# Altium schematic sheet SMPS.SchDoc: LiOn Drill Charger (part 1 of 3)
size A2; CompanyName: RADWAG Wagi Elektroniczne; Organization: RADWAG Wagi Elektroniczne; Address1: ul. Bracka 28; Address2: 26-600 RADOM; Address3: POLAND; SheetNumber: 1; SheetTotal: 1
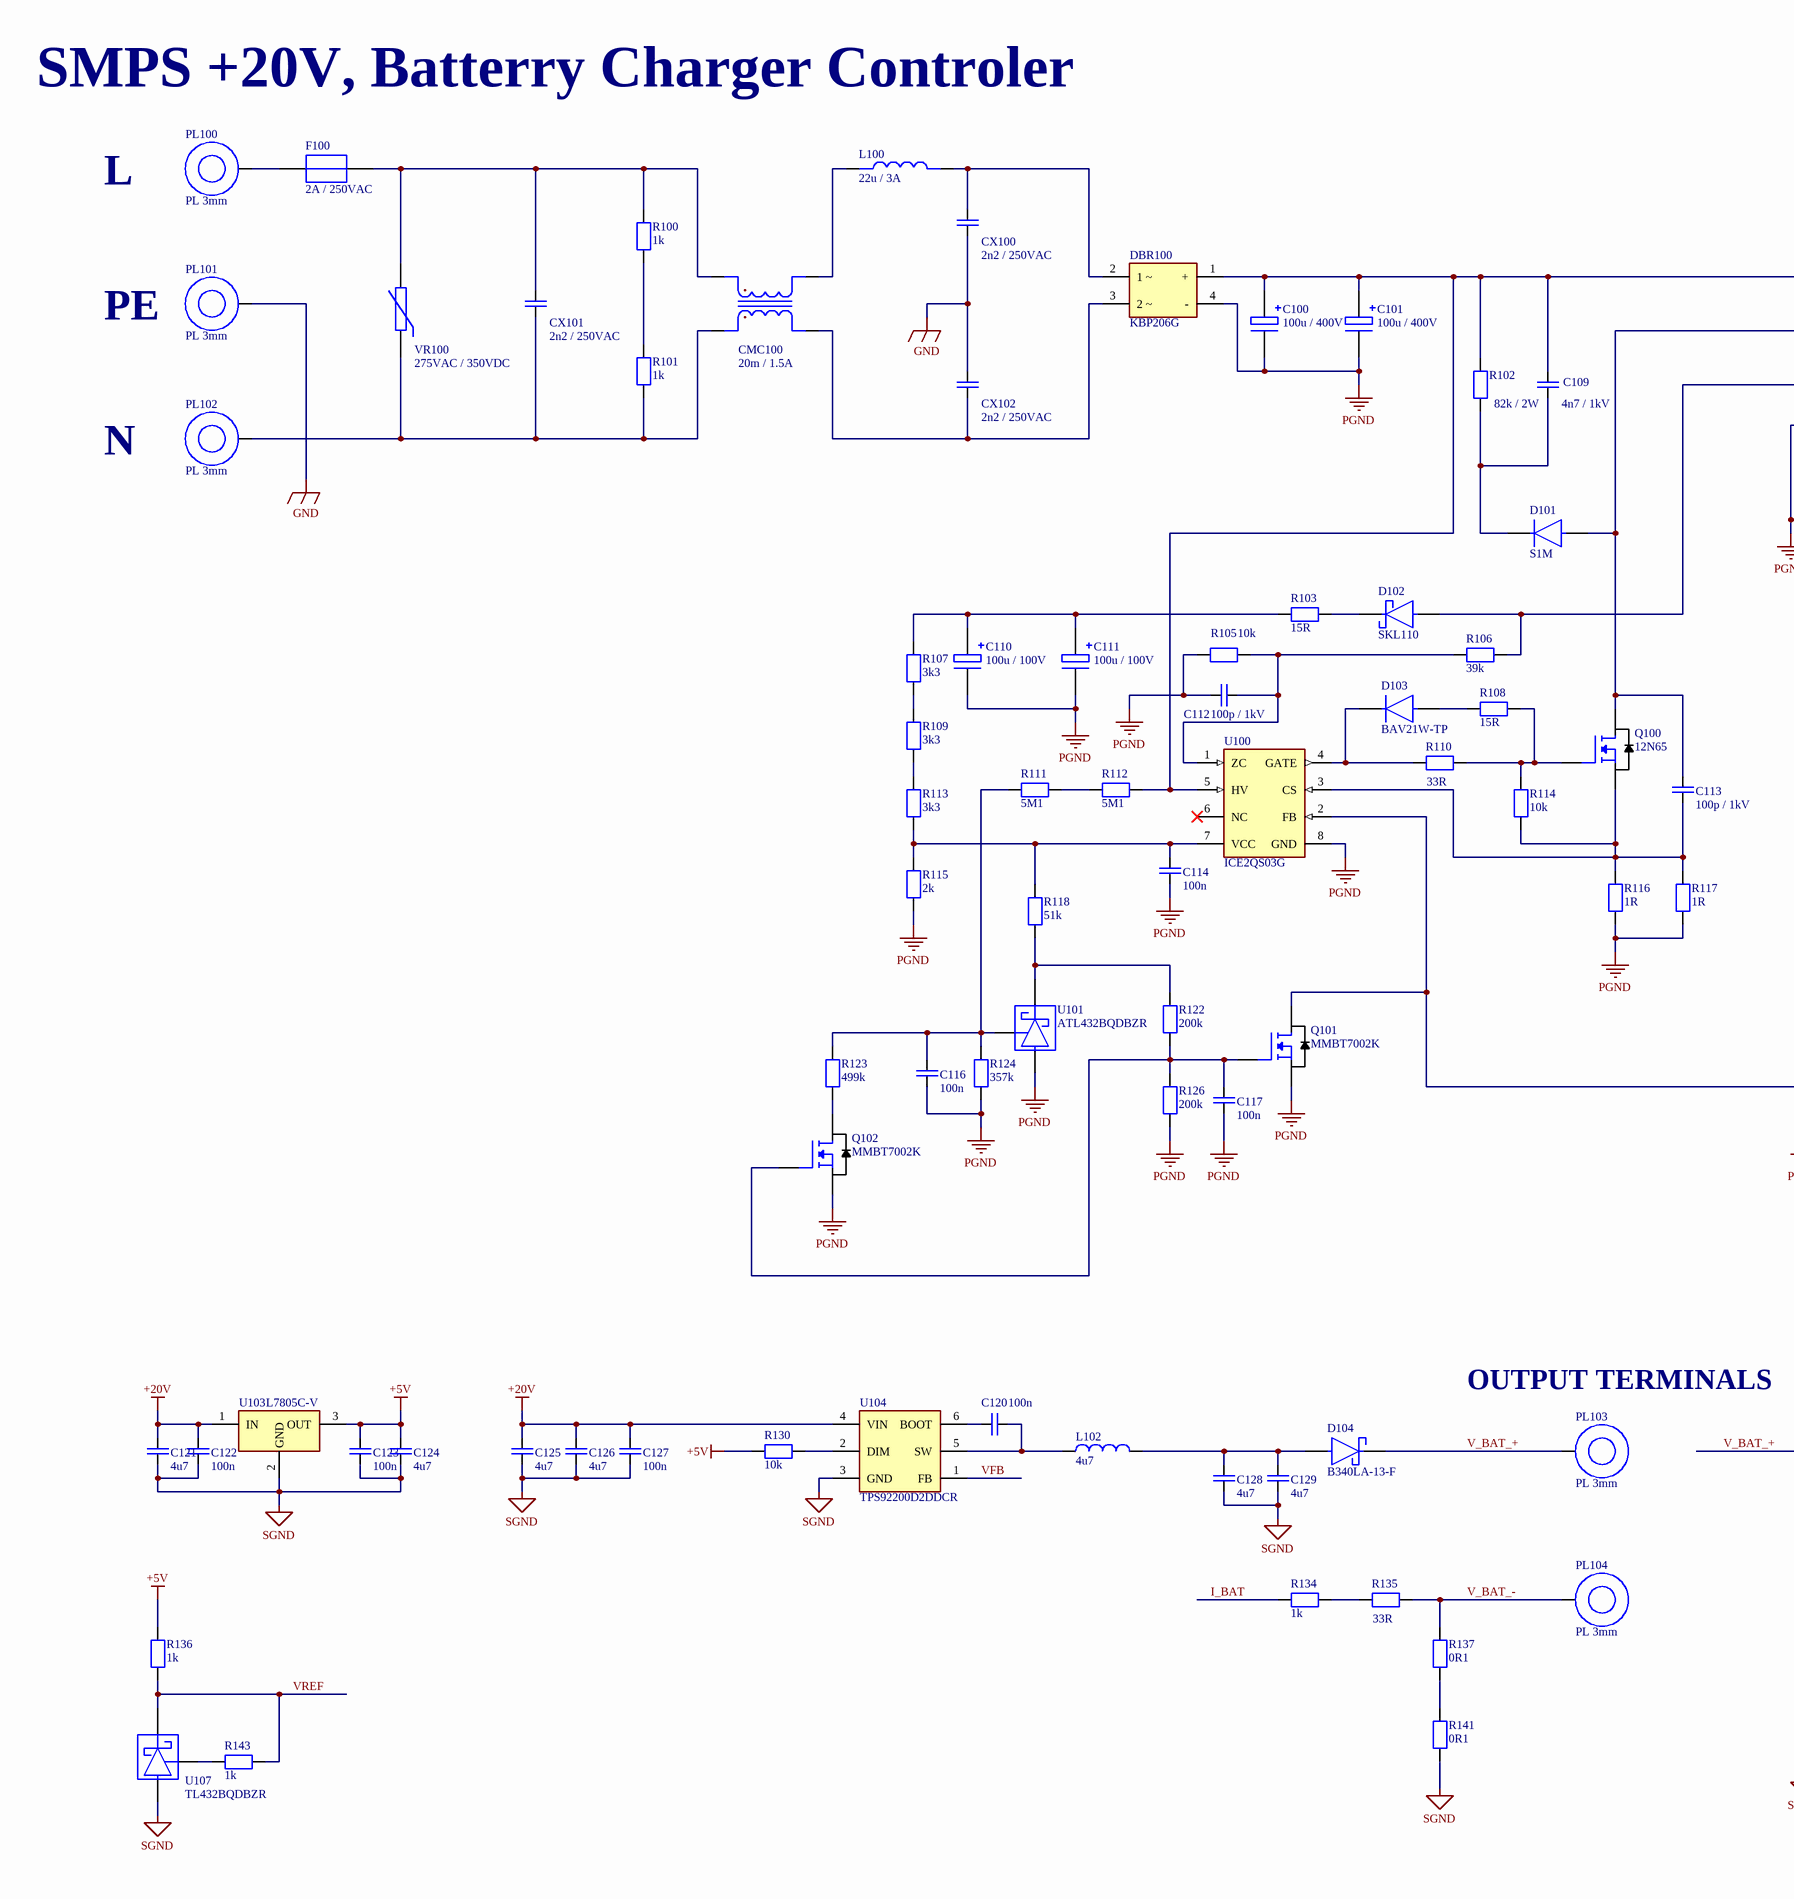
[diagram p0: SMPS.SchDoc, left]
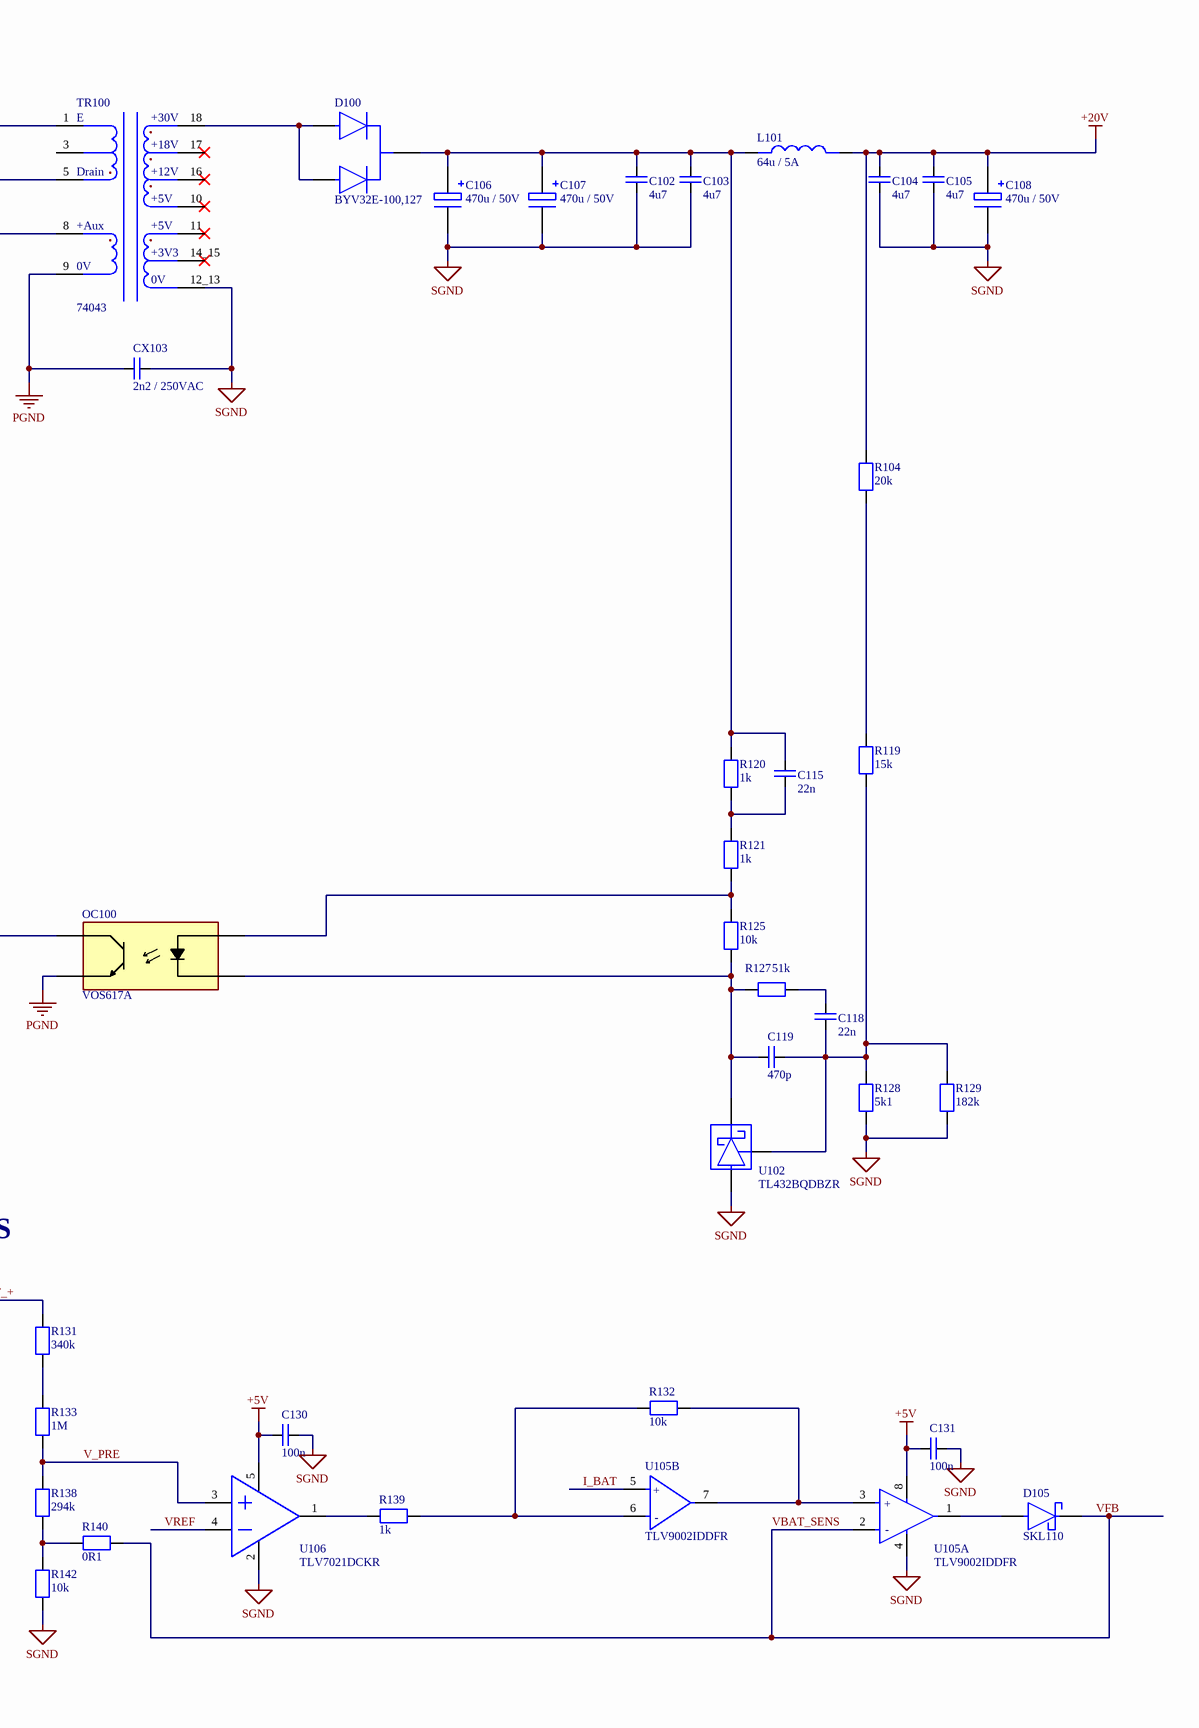
[diagram p1: SMPS.SchDoc, right]

## Parts
C100  100u / 400V  [EL_CAP_16X7_5]
C101  100u / 400V  [EL_CAP_16X7_5]
C102  4u7  [C0805]
C103  4u7  [C0805]
C104  4u7  [C0805]
C105  4u7  [C0805]
C106  470u / 50V  [EL_CAP_12_5X5]
C107  470u / 50V  [EL_CAP_12_5X5]
C108  470u / 50V  [EL_CAP_12_5X5]
C109  4n7 / 1kV  [C1206]
C110  100u / 100V  [EL_CAP_10X5]
C111  100u / 100V  [EL_CAP_10X5]
C112  100p / 1kV  [FILM_CAP_R5MM_4_5X6X7_2]
C113  100p / 1kV  [FILM_CAP_R5MM_4_5X6X7_2]
C114  100n  [C1206]
C115  22n  [C0603]
C116  100n  [C1206]
C117  100n  [C1206]
C118  22n  [C0603]
C119  470p  [C0603]
C120  100n  [C1206]
C121  4u7  [C0805]
C122  100n  [C1206]
C123  100n  [C1206]
C124  4u7  [C0805]
C125  4u7  [C0805]
C126  4u7  [C0805]
C127  100n  [C1206]
C128  4u7  [C0805]
C129  4u7  [C0805]
C130  100n  [C1206]
C131  100n  [C1206]
CMC100  20m / 1.5A  [EV28CMC]
CX100  2n2 / 250VAC  [CX_THT_CAP_R_7_5_FI8]
CX101  2n2 / 250VAC  [CX_THT_CAP_R_7_5_FI8]
CX102  2n2 / 250VAC  [CX_THT_CAP_R_7_5_FI8]
CX103  2n2 / 250VAC  [CX_THT_CAP_R_7_5_FI8]
D100  BYV32E-100,127  [TO220AB]
D101  S1M  [SMA]
D102  SKL110  [SOD123FL]
D103  BAV21W-TP  [SOD123FL]
D104  B340LA-13-F  [SMA]
D105  SKL110  [SOD123FL]
DBR100  KBP206G  [FP-KBP-MFG]
F100  2A / 250VAC  [FUSE_SMD_5X20]
L100  22u / 3A  [POWER_INDUCTOR_THT_8X14]
L101  64u / 5A  [POWER_INDUCTOR_THT_16X27]
L102  4u7  [WE-TPC-1028-XL]
OC100  VOS617A  [OC_SOP_4]
PL100  PL 3mm  [PL3MM]  (no BOM)
PL101  PL 3mm  [PL3MM]  (no BOM)
PL102  PL 3mm  [PL3MM]  (no BOM)
PL103  PL 3mm  [PL3MM]  (no BOM)
PL104  PL 3mm  [PL3MM]  (no BOM)
Q100  12N65  [TO220F]
Q101  MMBT7002K  [SOT23]
Q102  MMBT7002K  [SOT23]
R100  1k  [R1206]
R101  1k  [R1206]
R102  82k / 2W  [RAxialFi4]
R103  15R  [R1206]
R104  20k  [R0603]
R105  10k  [R1206]
R106  39k  [R1206]
R107  3k3  [R1206]
R108  15R  [R1206]
R109  3k3  [R1206]
R110  33R  [R1206]
R111  5M1  [R1206]
R112  5M1  [R1206]
R113  3k3  [R1206]
R114  10k  [R0603]
R115  2k  [R1206]
R116  1R  [R1206]
R117  1R  [R1206]
R118  51k  [R0603]
R119  15k  [R0603]
R120  1k  [R0603]
R121  1k  [R0603]
R122  200k  [R0603]
R123  499k  [R0603]
R124  357k  [R0603]
R125  10k  [R0603]
R126  200k  [R0603]
R127  51k  [R0603]
R128  5k1  [R0603]
R129  182k  [R0603]
R130  10k  [R0603]
R131  340k  [R0805]
R132  10k  [R0603]
R133  1M  [R0805]
R134  1k  [R0603]
R135  33R  [R1206]
R136  1k  [R0603]
R137  0R1  [R1206]
R138  294k  [R0805]
R139  1k  [R0603]
R140  0R1  [R1206]
R141  0R1  [R1206]
R142  10k  [R0805]
R143  1k  [R0603]
TR100  74043  [ERL28_MYRRA74043]
U100  ICE2QS03G  [PG_DSO_8]
U101  ATL432BQDBZR  [SOT23]
U102  TL432BQDBZR  [SOT23]
U103  L7805C-V  [TO220AB]
U104  TPS92200D2DDCR  [SOT23_6]
U105  TLV9002IDDFR  [SOT23_8]  (parts A,B of 2)
U106  TLV7021DCKR  [SOT23_5]
U107  TL432BQDBZR  [SOT23]
VR100  275VAC / 350VDC  [VAR_MOV_0_6X25]

## Nets
+5V: C123.1 C124.1 C130.2 C131.2 R130.1 R136.1 U103.3(OUT) U105.8(V+) U106.5
+20V: C104.1 C105.1 C108.1 C121.1 C122.1 C125.1 C126.1 C127.1 L101.2 R104.2 U103.1(IN) U104.4(VIN)
GND: CX100.2 CX102.1 PL101.1
PGND: C100.2 C101.2 C110.2 C111.2 C112.1 C114.2 C116.2 C117.2 CX103.1 DBR100.4(-) OC100.3(E) Q101.2 Q102.2 R105.2 R115.1 R116.1 R117.1 R124.1 R126.1 TR100.9 U100.8(GND) U101.3
SGND: C102.2 C103.2 C104.2 C105.2 C106.2 C107.2 C108.2 C121.2 C122.2 C123.2 C124.2 C125.2 C126.2 C127.2 C128.2 C129.2 C130.1 C131.1 CX103.2 R128.1 R129.1 R141.2 R142.1 TR100.12_13 U102.3 U103.2(GND) U104.3(GND) U105.4(V-) U106.2 U107.3
I_BAT: R134.2 U105.5(IN2+)
V_BAT_+: D104.1(C) PL103.1 R131.2
V_BAT_-: PL104.1 R135.2 R137.1
V_PRE: R133.1 R138.2 U106.3
VBAT_SENS: D105.1(C) R140.2 U104.1(FB) U105.2(IN1-)  [also labelled VFB]
VREF: R136.2 R143.2 U106.4 U107.2
NetC100_1: C100.1 C101.1 C109.1 DBR100.1(+) R102.2 R112.2 TR100.1 U100.5(HV)
NetC102_1: C102.1 C103.1 C106.1 C107.1 C115.2 D100.2 L101.1 R120.2
NetC109_2: C109.2 D101.1(C) R102.1
NetC110_1: C110.1 C111.1 R103.1 R107.2
NetC112_2: C112.2 R105.1 R106.1 U100.1(ZC)
NetC113_1: C113.1 D101.2(A) Q100.2 TR100.5
NetC113_2: C113.2 Q100.3 R114.2 R116.2 R117.2 U100.3(CS)
NetC114_1: C114.1 R113.1 R115.2 R118.2 U100.7(VCC)
NetC115_1: C115.1 R120.1 R121.2
NetC116_1: C116.1 R111.1 R123.2 R124.2 U101.1
NetC117_1: C117.1 Q101.1 Q102.1 R122.1 R126.2
NetC118_1: C118.1 C119.2 R119.1 R128.2 R129.2 U102.1
NetC118_2: C118.2 R127.1
NetC119_1: C119.1 OC100.2(C) R125.2 R127.2 U102.2
NetC120_1: C120.1 U104.6(BOOT)
NetC120_2: C120.2 L102.1 U104.5(SW)
NetC128_1: C128.1 C129.1 D104.2(A) L102.2
NetCMC100_1: CMC100.1 CX101.1 F100.2 R100.2 VR100.1
NetCMC100_2: CMC100.2 L100.1
NetCMC100_3: CMC100.3 CX102.2 DBR100.3(2_~)
NetCMC100_4: CMC100.4 CX101.2 PL102.1 R101.1 VR100.2
NetCX100_1: CX100.1 DBR100.2(1_~) L100.2
NetD100_1: D100.1 D100.3 TR100.18
NetD102_1: D102.1(C) R103.2
NetD102_2: D102.2(A) R106.2 TR100.8
NetD103_1: D103.1(C) R110.1 U100.4(GATE)
NetD103_2: D103.2(A) R108.1
NetD105_2: D105.2(A) U105.1(OUT1)
NetF100_1: F100.1 PL100.1
NetOC100_1: OC100.1(A) R121.1 R125.1
NetOC100_4: OC100.4(C) Q101.3 U100.2(FB)
NetQ100_1: Q100.1 R108.2 R110.2 R114.1
NetQ102_3: Q102.3 R123.1
NetR100_1: R100.1 R101.2
NetR104_1: R104.1 R119.2
NetR107_1: R107.1 R109.2
NetR109_1: R109.1 R113.2
NetR111_2: R111.2 R112.1
NetR118_1: R118.1 R122.2 U101.2
NetR130_2: R130.2 U104.2(DIM)
NetR131_1: R131.1 R133.2
NetR132_1: R132.1 R139.1 U105.6(IN2-)
NetR132_2: R132.2 U105.3(IN1+) U105.7(OUT2)
NetR134_1: R134.1 R135.1
NetR137_2: R137.2 R141.1
NetR138_1: R138.1 R140.1 R142.2
NetR139_2: R139.2 U106.1
NetR143_1: R143.1 U107.1

Not connected (* = marked no-connect by the designer): TR100 3 10* 11* 14_15* 16* 17*; U100 6(NC)*

## Notes on the sheet
- SMPS +20V, Batterry Charger Controler
- L
- PE
- N
- OUTPUT TERMINALS
- Title:
- Size: A3
- Sheet number:
- Page contents:
- Date:
- of
- Version:
- Drawn by:
- Issue:
- (in symbol 74043_MYRRA) E; +30V; +18V; Drain; +12V; +5V; +Aux; +3V3; 0V
- (in symbol TLV9002IDDFR, part A) +; -
- (in symbol TLV9002IDDFR, part B) +; -